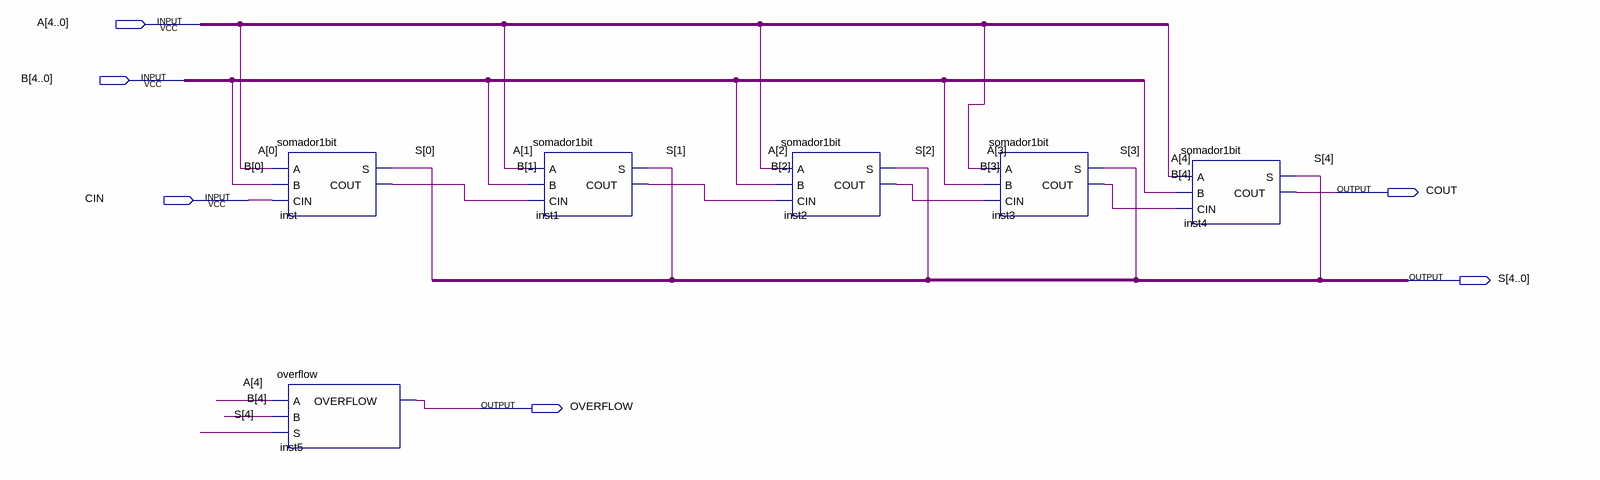
[diagram p0: schematic sheet]
// Quartus schematic somador5bit.bdf as structural Verilog: 6 symbols, 6 pins
module somador5bit (
  input  [4:0] A,
  input  [4:0] B,
  input  CIN,
  output COUT,
  output [4:0] S,
  output OVERFLOW
);

  wire inst1_cout, inst2_cout, inst3_cout, inst_cout;

  somador1bit inst (.A(A[0]), .B(B[0]), .CIN(CIN), .S(S[0]), .COUT(inst_cout));
  overflow inst5 (.A(A[4]), .B(B[4]), .S(S[4]), .OVERFLOW(OVERFLOW));
  somador1bit inst1 (.A(A[1]), .B(B[1]), .CIN(inst_cout), .S(S[1]), .COUT(inst1_cout));
  somador1bit inst2 (.A(A[2]), .B(B[2]), .CIN(inst1_cout), .S(S[2]), .COUT(inst2_cout));
  somador1bit inst3 (.A(A[3]), .B(B[3]), .CIN(inst2_cout), .S(S[3]), .COUT(inst3_cout));
  somador1bit inst4 (.A(A[4]), .B(B[4]), .CIN(inst3_cout), .S(S[4]), .COUT(COUT));
endmodule
